# EAGLE design PSoC Motor Driver Design 3 (EAGLE 7.5.0)
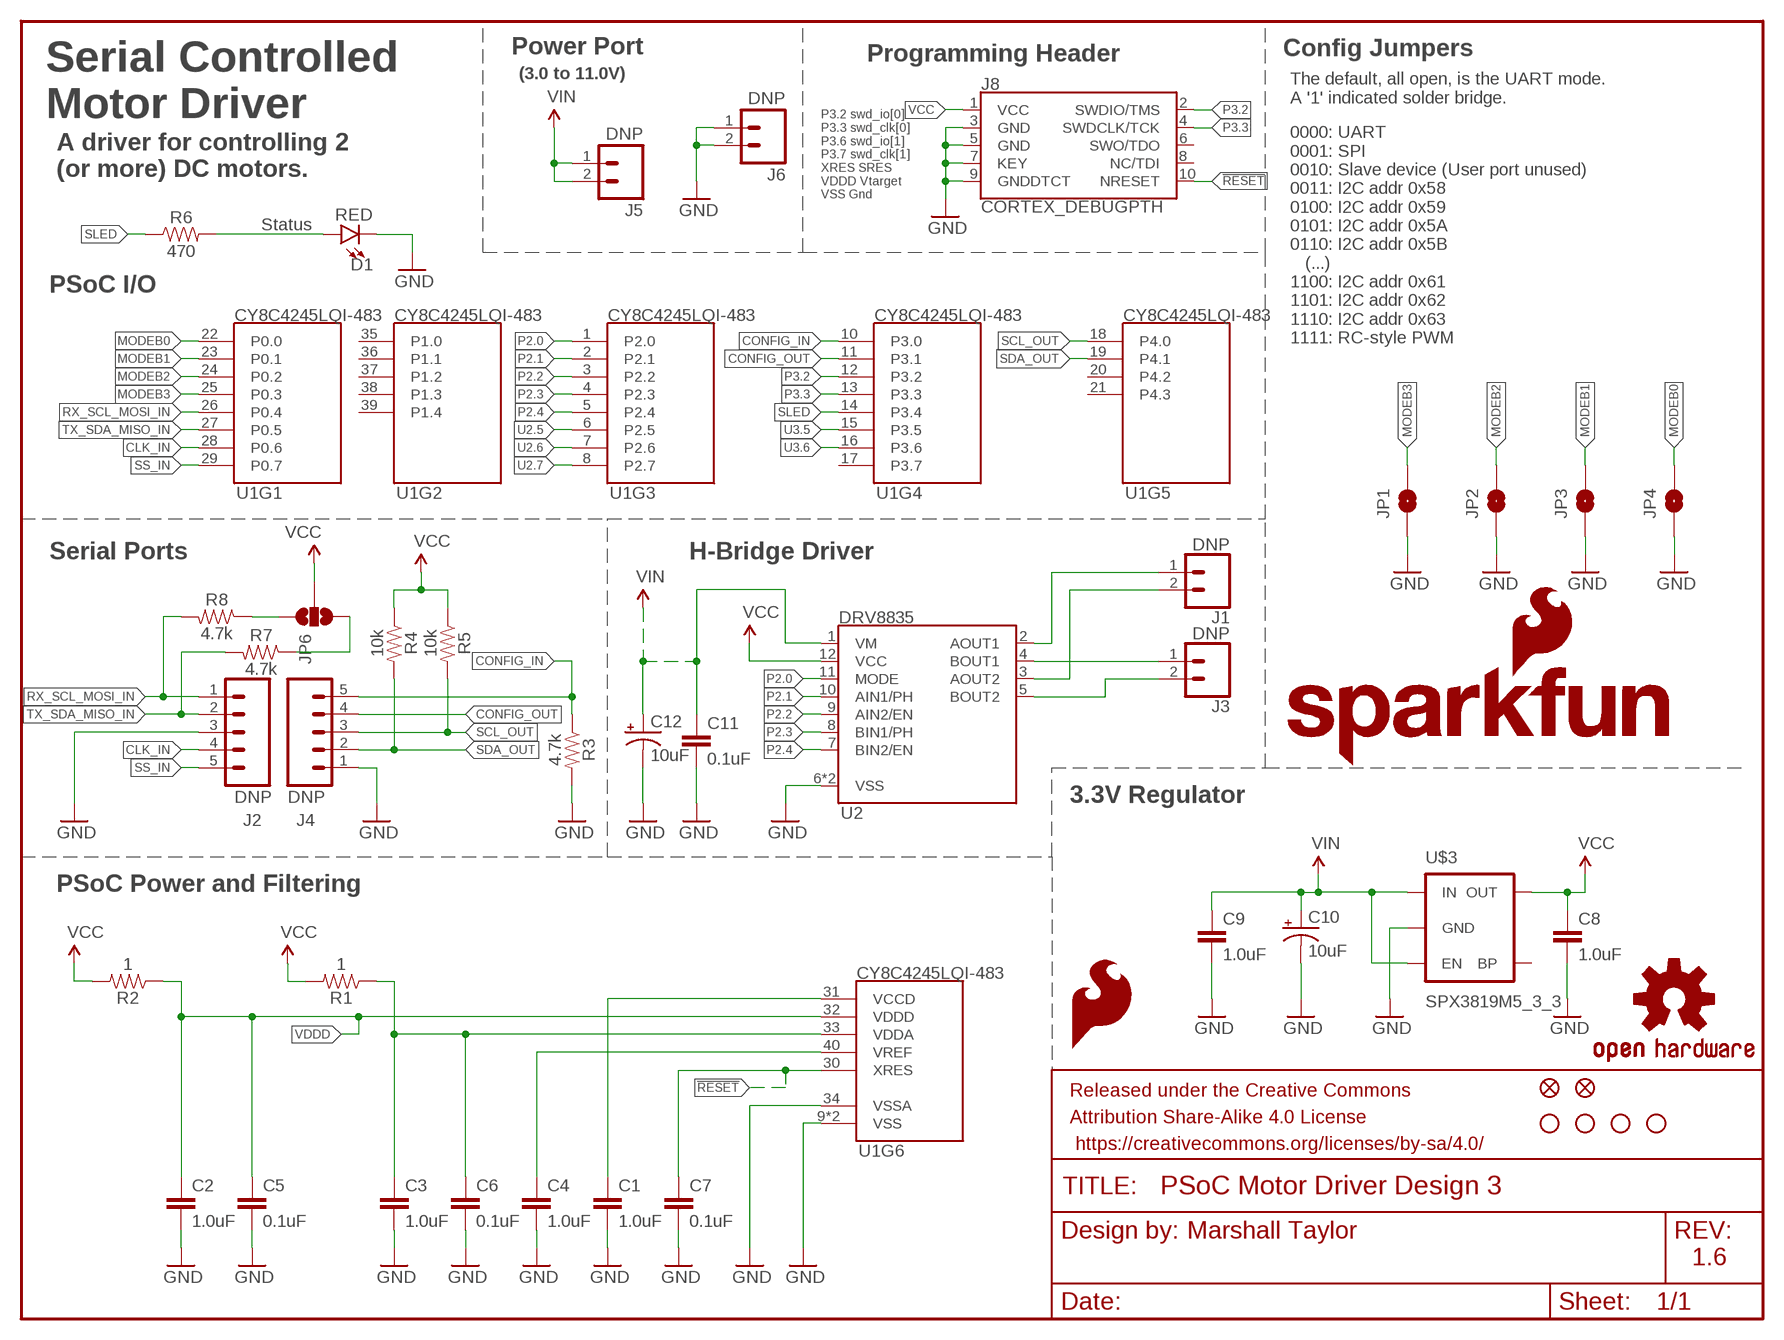
[diagram p0: schematic, sheet 1]

## Parts
C1  1.0uF  1.0UF-0402-16V-10%  [0402]
C2  1.0uF  1.0UF-0402-16V-10%  [0402]
C3  1.0uF  1.0UF-0402-16V-10%  [0402]
C4  1.0uF  1.0UF-0402-16V-10%  [0402]
C5  0.1uF  0.1UF-0402-16V-10%  [0402]
C6  0.1uF  0.1UF-0402-16V-10%  [0402]
C7  0.1uF  0.1UF-0402-16V-10%  [0402]
C8  1.0uF  1.0UF-0402-16V-10%  [0402]
C9  1.0uF  1.0UF-0402-16V-10%  [0402]
C10  10uF  10UF-POLAR-EIA3216-16V-10%(TANT)  [EIA3216]
C11  0.1uF  0.1UF-0402-16V-10%  [0402]
C12  10uF  10UF-POLAR-EIA3216-16V-10%(TANT)  [EIA3216]
D1  RED  LED-RED0603  [LED-0603]
FD1  FIDUCIALUFIDUCIAL  [MICRO-FIDUCIAL]
FD2  FIDUCIALUFIDUCIAL  [MICRO-FIDUCIAL]
FRAME1  FRAME-LETTER  [CREATIVE_COMMONS]
H1  STAND-OFF  [STAND-OFF]
H2  STAND-OFF  [STAND-OFF]
H3  STAND-OFF  [STAND-OFF]
H4  STAND-OFF  [STAND-OFF]
J1  DNP  CONN_021X02_NO_SILK  [1X02_NO_SILK]
J2  DNP  M05PTH  [1X05]
J3  DNP  CONN_021X02_NO_SILK  [1X02_NO_SILK]
J4  DNP  M05PTH  [1X05]
J5  DNP  M02PTH  [1X02@1]
J6  DNP  M02PTH  [1X02@1]
J8  CORTEX_DEBUGPTH  [2X5-PTH-1.27MM]
JP1  JUMPER-PAD-2  JUMPER-PAD-2-NOYES_SILK  [PAD-JUMPER-2-NO_YES_SILK]
JP2  JUMPER-PAD-2  JUMPER-PAD-2-NOYES_SILK  [PAD-JUMPER-2-NO_YES_SILK]
JP3  JUMPER-PAD-2  JUMPER-PAD-2-NOYES_SILK  [PAD-JUMPER-2-NO_YES_SILK]
JP4  JUMPER-PAD-2  JUMPER-PAD-2-NOYES_SILK  [PAD-JUMPER-2-NO_YES_SILK]
JP6  JUMPER-PAD-3-NOYES_SILK  [PAD-JUMPER-3-NO_YES_SILK]
LOGO1  SFE_LOGO_FLAME.1_INCH  [SFE_LOGO_FLAME_.1]
LOGO2  OSHW-LOGOMINI  [OSHW-LOGO-MINI]
LOGO3  SFE_LOGO_NAME_FLAME.1_INCH  [SFE_LOGO_NAME_FLAME_.1]
R1  1  1OHM-0603-1/10W-1%  [0603]
R2  1  1OHM-0603-1/10W-1%  [0603]
R3  4.7k  4.7KOHM-0603-1/10W-1%  [0603]
R4  10k  10KOHM-0603-1/10W-1%  [0603]
R5  10k  10KOHM-0603-1/10W-1%  [0603]
R6  470  470OHM-0603-1/10W-1%  [0603]
R7  4.7k  4.7KOHM-0603-1/10W-1%  [0603]
R8  4.7k  4.7KOHM-0603-1/10W-1%  [0603]
U1  CY8C4245LQI-483  CY8C4245LQI  [QFN-40]
U2  DRV8835  DRV883X  [WSON-12]
U$3  SPX3819M5_3_3  SPX3819  [SOT-23-5-VREG]

## Nets
!RESET: C7.1 J8.10(NRESET) U1.30(XRES)
AOUT1: J1.1 U2.2(AOUT1)
AOUT2: J1.2 U2.3(AOUT2)
BOUT1: J3.1 U2.4(BOUT1)
BOUT2: J3.2 U2.5(BOUT2)
CLK_IN: J2.4 U1.28(P0.6)
CONFIG_IN: J4.5 R3.1 U1.10(P3.0)
CONFIG_OUT: J4.4 U1.11(P3.1)
GND: C1.2 C2.2 C3.2 C4.2 C5.2 C6.2 C7.2 C8.2 C9.2 C10.- C11.2 C12.- D1.C J2.3 J4.1 J6.1 J6.2 J8.3(GND) J8.5(GND) J8.7(KEY) J8.9(GNDDTCT) JP1.1 JP2.1 JP3.1 JP4.1 R3.2 U1.9(VSS) U1.34(VSSA) U1.EP(VSS) U2.6(VSS) U2.PAD(VSS) U$3.2(GND)
MODEB0: JP4.2 U1.22(P0.0)
MODEB1: JP3.2 U1.23(P0.1)
MODEB2: JP2.2 U1.24(P0.2)
MODEB3: JP1.2 U1.25(P0.3)
N$1: C1.1 U1.31(VCCD)
N$3: C3.1 C6.1 R1.1 U1.33(VDDA)
N$4: C4.1 U1.40(VREF)
N$10: D1.A R6.2
N$11: JP6.1 R8.1
N$12: JP6.3 R7.1
P2.0: U1.1(P2.0) U2.11(MODE)
P2.1: U1.2(P2.1) U2.10(AIN1/PH)
P2.2: U1.3(P2.2) U2.9(AIN2/EN)
P2.3: U1.4(P2.3) U2.8(BIN1/PH)
P2.4: U1.5(P2.4) U2.7(BIN2/EN)
P3.2: J8.2(SWDIO/TMS) U1.12(P3.2)
P3.3: J8.4(SWDCLK/TCK) U1.13(P3.3)
RX_SCL_MOSI_IN: J2.1 R8.2 U1.26(P0.4)
SCL_OUT: J4.3 R5.2 U1.18(P4.0)
SDA_OUT: J4.2 R4.2 U1.19(P4.1)
SLED: R6.1 U1.14(P3.4)
SS_IN: J2.5 U1.29(P0.7)
TX_SDA_MISO_IN: J2.2 R7.2 U1.27(P0.5)
U2.5: U1.6(P2.5)
U2.6: U1.7(P2.6)
U2.7: U1.8(P2.7)
U3.5: U1.15(P3.5)
U3.6: U1.16(P3.6)
VCC: C8.1 J8.1(VCC) JP6.2 R1.2 R2.2 R4.1 R5.1 U2.12(VCC) U$3.5(OUT)
VDDD: C2.1 C5.1 R2.1 U1.32(VDDD)
VIN: C9.1 C10.+ C11.1 C12.+ J5.1 J5.2 U2.1(VM) U$3.1(IN) U$3.3(EN)
Unconnected: J8.6(SWO/TDO) J8.8(NC/TDI) U1.17(P3.7) U1.20(P4.2) U1.21(P4.3) U1.35(P1.0) U1.36(P1.1) U1.37(P1.2) U1.38(P1.3) U1.39(P1.4) U$3.4(BP)

## Notes on the sheet
- Serial Controlled
  Motor Driver
- Power Port | Programming Header | Config Jumpers
- The default, all open, is the UART mode.
  A '1' indicated solder bridge.
- (3.0 to 11.0V)
- P3.2 swd_io[0]
  P3.3 swd_clk[0]
  P3.6 swd_io[1]
  P3.7 swd_clk[1]
  XRES SRES
  VDDD Vtarget
  VSS Gnd
- 0000: UART
  0001: SPI
  0010: Slave device (User port unused)
  0011: I2C addr 0x58
  0100: I2C addr 0x59
  0101: I2C addr 0x5A
  0110: I2C addr 0x5B
     (...)
  1100: I2C addr 0x61
  1101: I2C addr 0x62
  1110: I2C addr 0x63
  1111: RC-style PWM
- A driver for controlling 2
  (or more) DC motors.
- Status
- PSoC I/O
- Serial Ports | H-Bridge Driver
- 3.3V Regulator
- PSoC Power and Filtering
- Marshall Taylor
- 1.6

## Library data of the parts
C1-C4 C8 C9 = SparkFun-Capacitors:1.0UF: 1µF ceramic capacitors A capacitor is a passive two-terminal electrical component used to store electrical energy temporarily in an electric field.; PROD_ID: CAP-12417
C5-C7 C11 = SparkFun-Capacitors:0.1UF: 0.1µF ceramic capacitors A capacitor is a passive two-terminal electrical component used to store electrical energy temporarily in an electric field.; PROD_ID: CAP-12416
C10 C12 = SparkFun-Capacitors:10UF-POLAR: 10.0µF polarized capacitors A capacitor is a passive two-terminal electrical component used to store electrical energy temporarily in an electric field.; PROD_ID: CAP-00811
D1 = SparkFun-LED:LED-RED: Red SMD LED Used in manufacturing of most products at SparkFun Packages: 0603 - SMD 0603 package [Product Link] <http://docs.avagotech.com/docs/AV02-0551EN> 0603 SMART - SMD 0603 SMART package ( more efficient and expensive)[Product Link] <http://www.osram-os.com/Graphics/XPic2/00077099_0.pdf> 1206 - SMD1206 package [Product Link] <https://www.sparkfun.com/datasheets/DevTools/LilyPad/Q150OVS4.pdff> SparkFun Products: Pro Mini 328 -5V <https://www.sparkfun.com/products/821> RedBoard <https://www.sparkfun.com/products/12757> IOIO-OTG <https://www.sparkfun.com/products/13613>; PROD_ID: DIO-00819
FD1 FD2 = SparkFun-Aesthetics:FIDUCIAL: Fiducial Alignment Points Various fiducial points for machine vision alignment.
FRAME1 = SparkFun-Aesthetics:FRAME-LETTER: Schematic Frame Standard 8.5x11 US Letter frame
H1-H4 = SparkFun-Electromechanical:STAND-OFF: #4 Stand Off This is the mechanical footprint for a #4 phillips button head screw. Use the keepout ring to avoid running the screw head into surrounding components. SKU : PRT-00447
J1 J3 = SparkFun-Connectors:CONN_02: Standard 2-pin 0.1" header. Use with - straight break away headers ( PRT-00116) - right angle break away headers (PRT-00553) - swiss pins (PRT-00743) - machine pins (PRT-00117) - female headers (PRT-00115) Molex polarized connector foot print use with: PRT-08233 with associated crimp pins and housings. 2.54_SCREWTERM for use with PRT-10571. 3.5mm Screw Terminal footprints for PRT-08084 5mm Screw Terminal footprints for use with PRT-08432
J2 J4 = SparkFun-Connectors:M05: Header 5 Standard 5-pin 0.1" header. Use with straight break away headers (SKU : PRT-00116), right angle break away headers (PRT-00553), swiss pins (PRT-00743), machine pins (PRT-00117), and female headers (PRT-00115). Molex polarized connector foot print use with SKU : PRT-08230 with associated crimp pins and housings.
J5 J6 = SparkFun-Connectors:M02: Standard 2-pin 0.1" header. Use with - straight break away headers ( PRT-00116) - right angle break away headers (PRT-00553) - swiss pins (PRT-00743) - machine pins (PRT-00117) - female headers (PRT-00115) Molex polarized connector foot print use with: PRT-08233 with associated crimp pins and housings. 2.54_SCREWTERM for use with PRT-10571. 3.5mm Screw Terminal footprints for PRT-08084 5mm Screw Terminal footprints for use with PRT-08432
J8 = Pete_Connectors_Retired:CORTEX_DEBUG: Cortex Debug Connector Datasheet <http://infocenter.arm.com/help/topic/com.arm.doc.faqs/attached/13634/cortex_debug_connectors.pdf>
JP1-JP4 = SparkFun-Passives:JUMPER-PAD-2-NO
JP6 = SparkFun-Passives:JUMPER-PAD-3-NO
LOGO1 = SparkFun-Aesthetics:SFE_LOGO_FLAME: SFE Logo, flame only This is the SparkFun flame logo. The logo on the schematic will always be the same size; the package variant is the height of the flame. Default layer for the logo on the board is tSilk.
LOGO2 = SparkFun-Aesthetics:OSHW-LOGO: Open Source Hardware Logo This logo indicates the piece of hardware it is found on incorporates a OSHW license and/or adheres to the definition of open source hardware found here: http://freedomdefined.org/OSHW
LOGO3 = SparkFun-Aesthetics:SFE_LOGO_NAME_FLAME: SFE Logo, name and flame This is the SparkFun full logo. The logo on the schematic will always be the same size; the package variant is the height of the flame part of the logo. Default layer for the logo on the board is tSilk.
R1 R2 = SparkFun-Resistors:1OHM: 1Ω resistor A resistor is a passive two-terminal electrical component that implements electrical resistance as a circuit element. Resistors act to reduce current flow, and, at the same time, act to lower voltage levels within circuits.; PROD_ID: RES-08269
R3 R7 R8 = SparkFun-Resistors:4.7KOHM: 4.7kΩ resistor A resistor is a passive two-terminal electrical component that implements electrical resistance as a circuit element. Resistors act to reduce current flow, and, at the same time, act to lower voltage levels within circuits.; PROD_ID: RES-07857
R4 R5 = SparkFun-Resistors:10KOHM: 10kΩ resistor A resistor is a passive two-terminal electrical component that implements electrical resistance as a circuit element. Resistors act to reduce current flow, and, at the same time, act to lower voltage levels within circuits.; PROD_ID: RES-00824
R6 = SparkFun-Resistors:470OHM: 470Ω resistor A resistor is a passive two-terminal electrical component that implements electrical resistance as a circuit element. Resistors act to reduce current flow, and, at the same time, act to lower voltage levels within circuits.; PROD_ID: RES-07869
U1 = PSOC4TempLib:CY8C4245LQI: PSOC 4200; PROD_ID: IC-13292
U2 = PSOC4TempLib:DRV883X; PROD_ID: IC-13342
U$3 = PSOC4TempLib:SPX3819; PROD_ID: VREG-13321

## Board
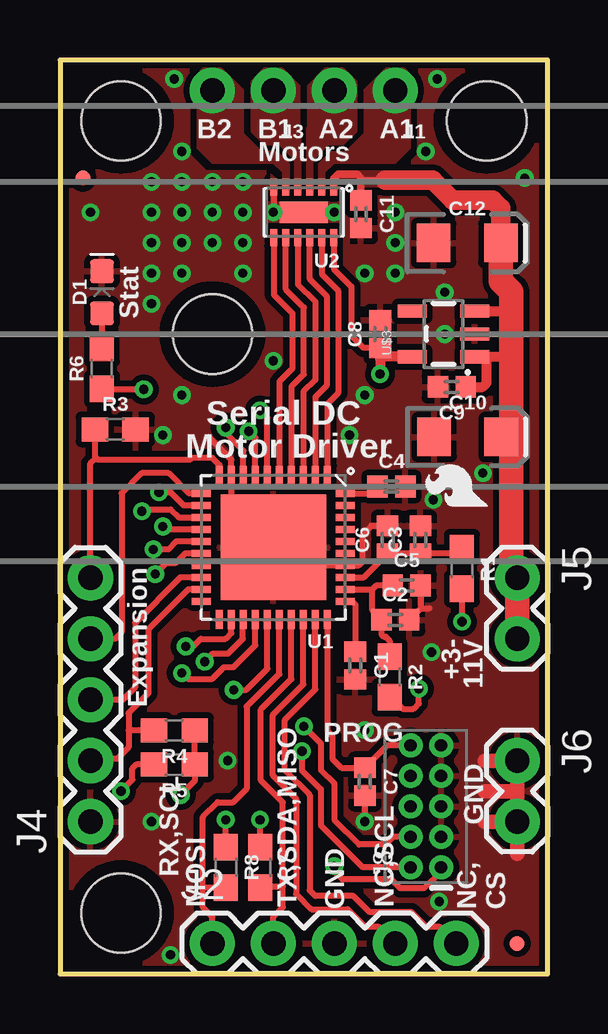
[diagram p1: board, top side]
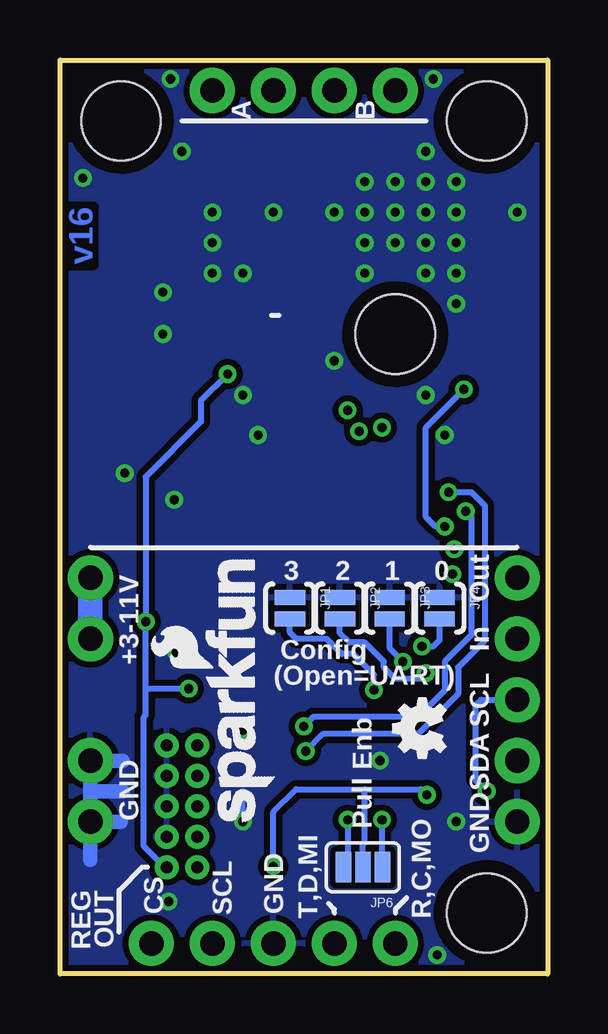
[diagram p2: board, bottom side, seen from below]

Size 20.32 x 38.1 mm. Coordinates in mm from the lower left corner, seen from the top.
Outline: 0,0 20.32,0 20.32,38.1 0,38.1 0,0
Copper layers (1*16): Top 0.035mm / dielectric 1.5mm / Bottom 0.035mm
Design rules "SparkFun-2-layer-TIGHT": minimum track width 7mil, minimum drill 15mil, track to track 7mil, track to pad 7mil, pad to pad 7mil, via to via 7mil, smd to smd 7mil, copper to edge 7mil, drill to drill 7mil, minimum pad ring 7mil, minimum via ring 7mil, stop-mask expansion 4mil, vias tented up to drill 25mil, thermal gap 10mil

### Footprints (pad centres in the part's own frame; a part is rotated, then mirrored left to right if it is on the bottom)
0402 = smd 0.85 x 0.9: 1 -0.58,0; 2 0.58,0
EIA3216 = smd 1.4 x 1.6: + 1.4,0; - -1.4,0
LED-0603 = smd 1 x 1: A -0.877,0; C 0.877,0
MICRO-FIDUCIAL = smd 0.635 x 0.635: 1 0,0
STAND-OFF = hole 3.302: 0,0
1X02_NO_SILK = drill 1.016 pad 1.88: 1 0,0; 2 2.54,0
1X05 = drill 1.016 pad 1.88: 1 0,0; 2 2.54,0; 3 5.08,0; 4 7.62,0; 5 10.16,0
1X02@1 = drill 1.016 pad 1.88: 1 0,0; 2 2.54,0
2X5-PTH-1.27MM = drill 0.508 pad 1: 1 -2.54,-0.635; 2 -2.54,0.635; 3 -1.27,-0.635; 4 -1.27,0.635; 5 0,-0.635; 6 0,0.635; 7 1.27,-0.635; 8 1.27,0.635; 9 2.54,-0.635; 10 2.54,0.635
PAD-JUMPER-2-NO_YES_SILK = smd 0.635 x 1.27: 1 -0.45,0; 2 0.45,0
PAD-JUMPER-3-NO_YES_SILK = smd 0.635 x 1.27: 1 -0.813,0; 2 0,0; 3 0.813,0
0603 = smd 1.1 x 1: 1 -0.85,0; 2 0.85,0
QFN-40 = smd 0.285 x 0.8: 1 -2.25,-3; 2 -1.75,-3; 3 -1.25,-3; 4 -0.75,-3; 5 -0.25,-3; 6 0.25,-3; 7 0.75,-3; 8 1.25,-3; 9 1.75,-3; 10 2.25,-3; 21 2.25,3; 22 1.75,3; 23 1.25,3; 24 0.75,3; 25 0.25,3; 26 -0.25,3; 27 -0.75,3; 28 -1.25,3; 29 -1.75,3; 30 -2.25,3 | smd 0.8 x 0.285: 11 3,-2.25; 12 3,-1.75; 13 3,-1.25; 14 3,-0.75; 15 3,-0.25; 16 3,0.25; 17 3,0.75; 18 3,1.25; 19 3,1.75; 20 3,2.25; 31 -3,2.25; 32 -3,1.75; 33 -3,1.25; 34 -3,0.75; 35 -3,0.25; 36 -3,-0.25; 37 -3,-0.75; 38 -3,-1.25; 39 -3,-1.75; 40 -3,-2.25 | smd 4.4 x 4.4: EP 0,0
WSON-12 = smd 0.3 x 0.7: 1 -1.25,-1.05; 2 -0.75,-1.05; 3 -0.25,-1.05; 4 0.25,-1.05; 5 0.75,-1.05; 6 1.25,-1.05; 7 1.25,1.05; 8 0.75,1.05; 9 0.25,1.05; 10 -0.25,1.05; 11 -0.75,1.05; 12 -1.25,1.05 | smd 2 x 0.9: PAD 0,0
SOT-23-5-VREG = smd 0.55 x 1.2: 1 -0.95,-1.3; 2 0,-1.3; 3 0.95,-1.3; 4 0.95,1.3; 5 -0.95,1.3

### Placement (x,y rotation side)
C1  12.3,12.86 270 top
C2  13.97,14.76 0 top
C3  15.02,18.1 90 top
C4  13.81,20.32 0 top
C5  14.45,16.19 0 top
C6  13.65,18.1 90 top
C7  12.7,8.02 270 top
C8  13.34,26.67 90 top
C9  16.33,24.47 180 top
C10  16.99,22.38 0 top
C11  12.54,31.67 270 top
C12  16.97,30.47 0 top
D1  1.75,28.42 90 top
FD1  19.05,1.27 90 top
FD2  0.95,33.18 90 top
FRAME1  -21.59,-27.94 0 top  (outside the outline)
H1  6.35,26.67 0 top
H2  2.54,35.56 0 top
H3  17.78,35.56 0 top
H4  2.54,2.54 0 top
J1  13.97,36.83 180 top
J2  6.35,1.27 0 top
J3  8.89,36.83 180 top
J4  1.27,6.35 90 top
J5  19.05,16.51 270 top
J6  19.05,8.89 270 top
J8  15.24,6.99 90 top
JP1  10.74,15.25 270 bottom
JP2  8.66,15.25 270 bottom
JP3  6.58,15.25 270 bottom
JP4  4.5,15.25 270 bottom
JP6  7.7,4.45 180 bottom
LOGO1  18.15,19.2 90 top
LOGO2  5.24,10.24 90 bottom
LOGO3  11.31,5.91 90 bottom
R1  16.75,16.91 270 top
R2  13.73,12.38 270 top
R3  2.3,22.7 0 top
R4  4.76,10.16 180 top
R5  4.76,8.73 180 top
R6  1.75,25.24 90 top
R7  8.33,4.45 270 top
R8  6.91,4.45 270 top
U1  8.89,17.78 180 top
U2  10.16,31.75 180 top
U$3  15.98,26.68 90 top

### Tracks (layer width: path | path; a pad name or v marks a point on that pad's centre or on a via)
!RESET
  Top 0.254: U1.30 11.14,10.13 11.35,9.92 11.35,8.97 11.72,8.6 C7.1 13.63,9.53 J8.10
AOUT1
  pour Top (no thermals): 12.66,36.86 13.58,37.77 14.36,37.77 14.62,37.52 14.62,34.43 13.97,33.78 11.43,33.78 11.06,33.41 11.06,33.11 10.76,33.11 10.76,33.77 11.28,34.29 11.91,34.29 12.66,35.04
AOUT2
  pour Top (no thermals): 11.04,37.77 10.3,37.03 10.3,35.31 10.26,35.27 10.26,33.07 10.55,33.07 10.55,33.92 11.18,34.54 11.81,34.54 12.38,35.12 12.38,37.21 11.82,37.77
BOUT1
  pour Top (no thermals): 9.28,37.77 10.02,37.03 10.02,35.31 10.06,35.27 10.06,33.07 9.77,33.07 9.77,33.92 9.14,34.54 8.51,34.54 7.94,35.12 7.94,37.21 8.5,37.77
BOUT2
  pour Top (no thermals): 7.66,36.86 6.74,37.77 5.96,37.77 5.7,37.52 5.7,34.43 6.35,33.78 8.89,33.78 9.26,33.41 9.26,33.11 9.56,33.11 9.56,33.77 9.04,34.29 8.41,34.29 7.66,35.04
CLK_IN
  Top 0.254: J2.4 13.26,1.98 12.7,1.98 11.99,2.7 10.48,2.7 9.84,3.33 9.84,7.3 8.87,8.28 8.87,10.81 10.14,12.08 U1.28
CONFIG_IN
  Top 0.254: U1.10 6.64,21.22 6.35,21.51 5.48,21.51 5.4,21.43 1.59,21.43 1.51,21.51 | J4.5 1.27,21.27 1.51,21.51 | R3.1 1.45,21.57 1.51,21.51
CONFIG_OUT
  Top 0.254: J4.4 2.3,13.97 2.57,14.24 2.57,20.03 3.41,20.88 4.52,20.88 5.37,20.03 U1.11
GND  (via drill 0.38)
  Top 0.254: U2.6 8.91,31.98 8.97,31.93 | C6.2 12.96,18.68 12.62,18.34 12.62,17.19 12.46,17.03 U1.34 10.67,17.03 10.48,17.22 9.45,17.22 U1.EP | 7.38,19.21 7.14,19.45 U1.9 7.14,21.43 6.19,22.38 | C7.2 v12.7,6.35 | C1.2 12.28,12.28 | C5.2 15.03,15.24 | 15.03,15.24 C2.2 | 15.03,15.24 15.4,15.24
  Top 0.61: 17.7,7.62 19.05,7.62 | 17.7,8.89 J6.1 19.05,7.62 | 17.7,6.35 J6.2 | 19.05,5 J6.2 | J6.2 19.05,7.62
  Bottom 0.254: v12.7,6.35 12.7,7.62
  Bottom 0.61: 17.7,8.89 J6.1 19.05,7.62 | 19.05,7.62 J6.2 | J6.2 19.05,4.76 | J6.2 17.78,6.35 | 19.05,7.62 17.7,7.62
  other vias: 19.37,33.18 15.72,37.31 8.89,31.75 11.43,31.75 7.62,31.75 7.62,33.02 7.62,30.48 6.35,30.48 6.35,31.75 6.35,33.02 5.08,33.02 5.08,31.75 5.08,30.48 13.97,31.75 13.97,30.48 13.97,29.21 12.7,29.21 7.62,29.21 5.08,29.21 3.81,29.21 3.81,27.94 3.81,30.48 3.81,31.75 3.81,33.02 15.24,34.29 5.08,34.29 4.76,37.31 16.03,26.67 16.03,28.42 17.62,20.88 15.56,19.76 12.7,24.13 12.06,22.46 8.89,25.56 5.08,24.13 15.48,13.41 15.8,3.02 3.81,6.35 6.99,8.89 12.7,10.16 4.6,0.79 4.29,22.46 1.27,31.75
  pour Bottom (isolate 0.254): 0,38.1 0,0 20.32,0 20.32,38.1
  pour Top (isolate 0.254, rank 2): 0,38.1 0,0 20.32,0 20.32,38.1
  pour Top (no thermals): 12.06,30.23 12.06,30.66 12.1,30.66 12.1,31.52 12.03,31.52 11.84,31.71 11.65,31.71 11.65,31.37 11.81,31.2 11.81,30.23
MODEB0  (via drill 0.38)
  Top 0.254: v5.24,13.65 5.56,13.65 5.87,13.97 6.9,13.97 7.14,14.2 U1.22
  Bottom 0.254: v5.24,13.65 4.76,13.65 4.5,13.91 JP4.2
MODEB1  (via drill 0.38)
  Top 0.254: v6.03,13.02 6.37,13.36 7,13.36 7.62,13.97 7.62,14.76 U1.23
  Bottom 0.254: v6.03,13.02 6.58,13.56 JP3.2
MODEB2  (via drill 0.38)
  Top 0.254: v5.08,12.54 5.32,12.3 6.35,12.3 6.83,12.78 7.22,12.78 8.14,13.7 U1.24
  Bottom 0.254: JP2.2 8.66,14.22 8.26,13.81 7.62,13.81 6.83,13.02 6.83,12.78 6.35,12.3 5.32,12.3 v5.08,12.54
MODEB3  (via drill 0.38)
  Top 0.254: v7.24,11.84 7.76,11.84 8.64,12.72 U1.25
  Bottom 0.254: JP1.2 10.74,14.23 10.48,13.97 9.21,13.97 8.57,13.34 8.1,13.34 7.24,12.48 v7.24,11.84
N$1
  Top 0.254: U1.31 12.17,15.53 12.3,15.4 C1.1
N$3
  Top 0.254: U1.33 12.66,16.53 C6.1 C3.1 16.51,17.52 R1.1
N$4
  Top 0.254: U1.40 12.94,20.03 C4.1
N$10
  Top 0.254: D1.A R6.2
N$11  (via drill 0.38)
  Top 0.254: R8.1 v6.91,6.43
  Bottom 0.254: v6.91,6.43 6.91,4.46 JP6.1
N$12  (via drill 0.38)
  Top 0.254: R7.1 v8.33,6.43
  Bottom 0.254: v8.33,6.43 8.33,4.62 JP6.3
P2.0
  Top 0.254: U2.11 10.91,29.17 11.59,28.5 11.59,24.21 11.14,23.76 U1.1
P2.1
  Top 0.254: U2.10 10.41,28.96 11.11,28.26 11.11,24.53 10.64,24.05 U1.2
P2.2
  Top 0.254: U2.9 9.91,28.75 10.64,28.02 10.64,24.77 10.14,24.27 U1.3
P2.3
  Top 0.254: U2.8 9.41,28.53 10.16,27.78 10.16,25 9.64,24.48 U1.4
P2.4
  Top 0.254: U2.7 8.91,28.32 9.68,27.54 9.68,25.24 9.14,24.7 U1.5
P3.2  (via drill 0.38)
  Top 0.254: J8.2 12.62,4.45 10.87,6.19 10.87,7.7 10.08,8.49 v10.08,9.29 | v4.13,20.08 4.6,20.08 5.16,19.53 U1.12
  Bottom 0.254: v10.08,9.29 9.37,10 5.4,10 3.73,11.67 3.73,12.78 2.62,13.89 2.62,19.53 3.17,20.08 v4.13,20.08
P3.3  (via drill 0.38)
  Top 0.254: v10.16,10.32 10.87,9.6 10.87,8.49 11.43,7.94 11.43,6.43 12.46,5.4 13.57,5.4 13.89,5.71 J8.4 | v3.41,19.29 3.49,19.37 4.6,19.37 4.94,19.03 U1.13
  Bottom 0.254: v10.16,10.32 9.76,10.72 5.4,10.72 4.29,11.83 4.29,13.02 3.17,14.13 3.17,19.05 v3.41,19.29
RX_SCL_MOSI_IN
  Top 0.254: J2.1 6.35,2.38 5.95,2.78 5.95,3.57 | 5.95,3.57 5.95,6.54 6.57,7.16 7.22,7.16 7.78,7.71 7.78,11.14 9.14,12.51 U1.26 | R8.2 5.98,3.6 5.95,3.57
SCL_OUT  (via drill 0.38)
  Top 0.254: U1.18 5.02,16.53 3.13,14.64 3.13,11.94 2.62,11.43 J4.3 | R5.2 3.17,8.73 3.02,8.57 3.02,8.1 v2.54,7.62
  Bottom 0.254: J4.3 2.78,11.43 3.02,11.19 3.02,8.1 v2.54,7.62
SDA_OUT
  Top 0.254: U1.19 5.35,16.03 3.68,14.37 3.68,11.7 2.86,10.87 2.86,10.16 | 2.86,10.16 2.86,9.45 2.38,8.97 1.35,8.97 J4.2 | R4.2 2.86,10.16
SLED  (via drill 0.38)
  Top 0.254: v3.49,24.37 1.77,24.37 R6.1 | U1.14 4.41,18.53 v4.29,18.65
  Bottom 0.254: v3.49,24.37 5.08,22.78 5.08,19.05 4.68,18.65 v4.29,18.65
SS_IN
  Top 0.254: J2.5 15.8,1.98 15.24,1.98 14.65,2.57 12.91,2.57 12.22,3.25 10.64,3.25 10.4,3.49 10.4,7.46 9.37,8.49 9.37,10.59 10.64,11.86 U1.29
TX_SDA_MISO_IN
  Top 0.254: J2.2 8.89,2.38 9.29,2.78 9.29,3.65 | 9.29,3.65 9.29,7.14 8.37,8.06 8.37,11.02 9.64,12.29 U1.27 | R7.2 8.39,3.65 9.29,3.65
U2.5  (via drill 0.38)
  Top 0.254: U1.6 8.64,23.19 v8.33,23.5
U2.6  (via drill 0.38)
  Top 0.254: U1.7 8.14,22.34 v7.86,22.62
U2.7  (via drill 0.38)
  Top 0.254: U1.8 7.64,21.81 6.91,22.54 v6.91,22.78
U3.5  (via drill 0.38)
  Top 0.254: U1.15 4.85,18.03 4.52,17.7 v3.89,17.7
U3.6  (via drill 0.38)
  Top 0.254: U1.16 5.23,17.53 4.83,17.13 4.43,17.13 v3.97,16.67
VCC  (via drill 0.38)
  Top 0.254: R4.1 R5.1 5.61,8.04 v5.03,7.46 | J8.1 15.88,4.29 15.16,3.57 14.18,3.57 13.81,3.94 11.78,3.94 11.43,4.29 v11.43,4.49 | U2.12 11.41,29.39 12.14,28.65 12.14,26.61 12.66,26.09 C8.1 13.71,25.73 U$3.5 | 13.49,11.19 13.81,11.51 13.93,11.39 | R1.2 v16.75,14.68 | 13.43,25.73 13.34,25.64 | 13.93,11.39 14.27,11.05 14.73,11.05 14.95,11.27 v14.95,11.89 | R2.2 13.79,11.53 13.93,11.39
  Top 0.406: U$3.5 13.43,25.73 | 13.34,25.64 v13.34,25
  Bottom 0.254: JP6.2 7.7,5.4 7.62,5.48 7.62,7.7 | v13.34,25 14.45,23.89 14.45,23.02 16.75,20.72 v16.75,14.68 16.75,11.81 | J8.1 15.95,4.45 16.83,5.32 16.83,10.72 16.75,10.79 16.75,11.81 | v11.43,4.49 11.43,6.75 10.48,7.7 7.62,7.7 | 7.62,7.7 5.27,7.7 v5.03,7.46 | v14.95,11.89 16.67,11.89 16.75,11.81
VDDD
  Top 0.254: C5.1 13.18,16.19 13.01,16.03 | U1.32 13.01,16.03 | 13.01,16.03 13.02,16.03 13.02,15.16 13.39,14.79 C2.1 13.39,14.15 13.49,14.05 13.57,14.05 13.73,13.89 R2.1
VIN
  Top 0.254: 18.74,27.63 18.8,27.69 | U$3.1 17.78,25.73 | 18.72,25.73 18.8,25.65 | 13.56,33.09 12.63,33.09 12.54,33.18
  Top 0.305: U2.1 11.41,33.16 11.59,33.34 12.38,33.34 12.54,33.18 C11.1
  Top 0.406: U$3.3 18.74,27.63 | 18.72,25.73 17.78,25.73 17.78,24.64 17.61,24.47 C9.1
  Top 0.813: 13.56,33.09 15.54,33.09 16.37,32.26 18.03,32.26 18.37,31.92 C12.+ | C10.+ 18.64,22.38 18.8,22.23
  Top 1.016: C12.+ 18.37,28.87 18.8,28.45 18.8,27.69 18.8,25.65 18.8,22.23 18.8,16.76 J5.1 J5.2
  Bottom 1.016: J5.2 J5.1
  pour Top (no thermals): 12.33,33.49 13.5,33.49 13.5,32.82 13.51,32.8 12.4,32.8 12.4,33.02 11.63,33.02 11.56,32.94 11.43,32.94 11.43,33.27 12.33,33.27

### Text on the board
Bottom: v16
tPlace: B2 | B1 | A2 | A1 | Motors | Stat | Serial DC / Motor Driver | +3- / 11V | Expansion | PROG | GND | RX,SCL | MOSI | TX,SDA,MISO | GND | NC,SCL | NC, / CS
bPlace: B | A | Out | 0 | 1 | 2 | 3 | In | Config | +3-11V | (Open=UART) | SCL | SDA | Pull Enb | GND | GND | GND | CS | REG / OUT | R,C,MO | T,D,MI | SCL
Measures: Measurements in inches.
tDocu: These lines depict the width of / typical TO-220 heatsinks. | Marshall Taylor